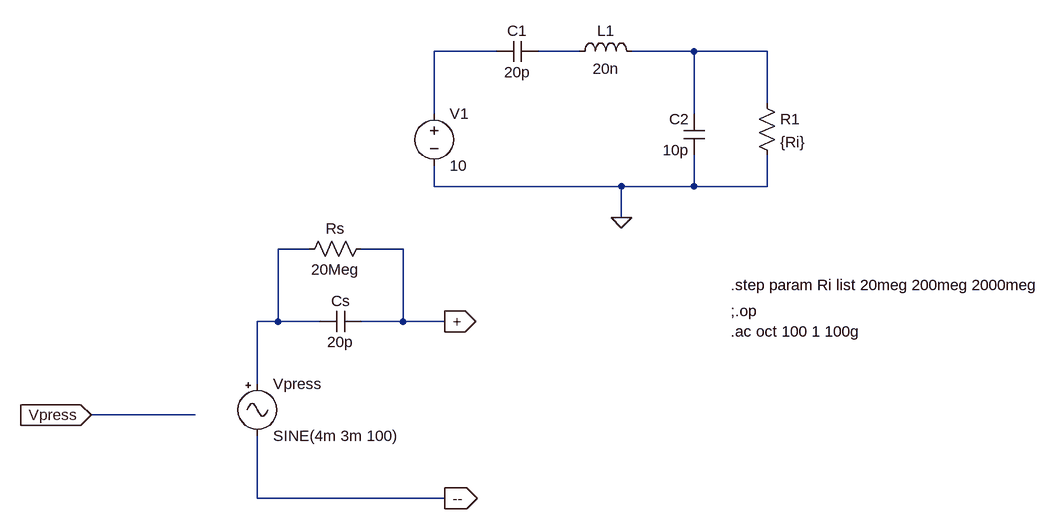
[diagram p0: schematic SENSOR_PZE.asc]
SENSOR_PZE.asc, the LTspice schematic file:
Version 4
SHEET 1 960 940
WIRE 112 192 16 192
WIRE 240 192 176 192
WIRE 416 192 320 192
WIRE 528 192 416 192
WIRE 528 272 528 192
WIRE 16 288 16 192
WIRE 416 288 416 192
WIRE 16 400 16 368
WIRE 304 400 16 400
WIRE 416 400 416 352
WIRE 416 400 304 400
WIRE 528 400 528 352
WIRE 528 400 416 400
WIRE 304 448 304 400
WIRE -176 496 -224 496
WIRE -32 496 -96 496
WIRE -224 608 -224 496
WIRE -224 608 -256 608
WIRE -160 608 -224 608
WIRE -32 608 -32 496
WIRE -32 608 -96 608
WIRE 32 608 -32 608
WIRE -256 704 -256 608
WIRE -352 752 -512 752
WIRE -256 880 -256 784
WIRE 32 880 -256 880
FLAG 304 448 0
FLAG -512 752 Vpress
IOPIN -512 752 In
FLAG 32 608 +
IOPIN 32 608 Out
FLAG 32 880 --
IOPIN 32 880 Out
SYMBOL voltage 16 272 R0
SYMATTR InstName V1
SYMATTR Value 10
SYMATTR Value2 AC 1
SYMBOL cap 176 176 R90
WINDOW 0 0 32 VBottom 2
WINDOW 3 32 32 VTop 2
SYMATTR InstName C1
SYMATTR Value 20p
SYMBOL cap 432 352 R180
WINDOW 0 24 56 Left 2
WINDOW 3 24 8 Left 2
SYMATTR InstName C2
SYMATTR Value 10p
SYMBOL res 512 256 R0
SYMATTR InstName R1
SYMATTR Value {Ri}
SYMBOL ind 224 208 R270
WINDOW 0 32 56 VTop 2
WINDOW 3 5 56 VBottom 2
SYMATTR InstName L1
SYMATTR Value 20n
SYMBOL cap -96 592 R90
WINDOW 0 0 32 VBottom 2
WINDOW 3 32 32 VTop 2
SYMATTR InstName Cs
SYMATTR Value 20p
SYMBOL res -80 480 R90
WINDOW 0 0 56 VBottom 2
WINDOW 3 32 56 VTop 2
SYMATTR InstName Rs
SYMATTR Value 20Meg
SYMBOL Misc/signal -256 688 R0
SYMATTR InstName Vpress
SYMATTR Value SINE(4m 3m 100)
TEXT 472 592 Left 2 !;.op\n.ac oct 100 1 100g
TEXT 472 552 Left 2 !.step param Ri list 20meg 200meg 2000meg

The netlist it stands for:
* SENSOR_PZE.asc
V1 N001 0 10 AC 1
C1 N002 N001 20p
C2 0 N003 10p
R1 N003 0 {Ri}
L1 N002 N003 20n
Cs + N004 20p
Rs + N004 20Meg
Vpress N004 -- SINE(4m 3m 100)
;.op
.ac oct 100 1 100g
.step param Ri list 20meg 200meg 2000meg
.backanno
.end